# Altium schematic sheet BMS Module.SchDoc
size A3
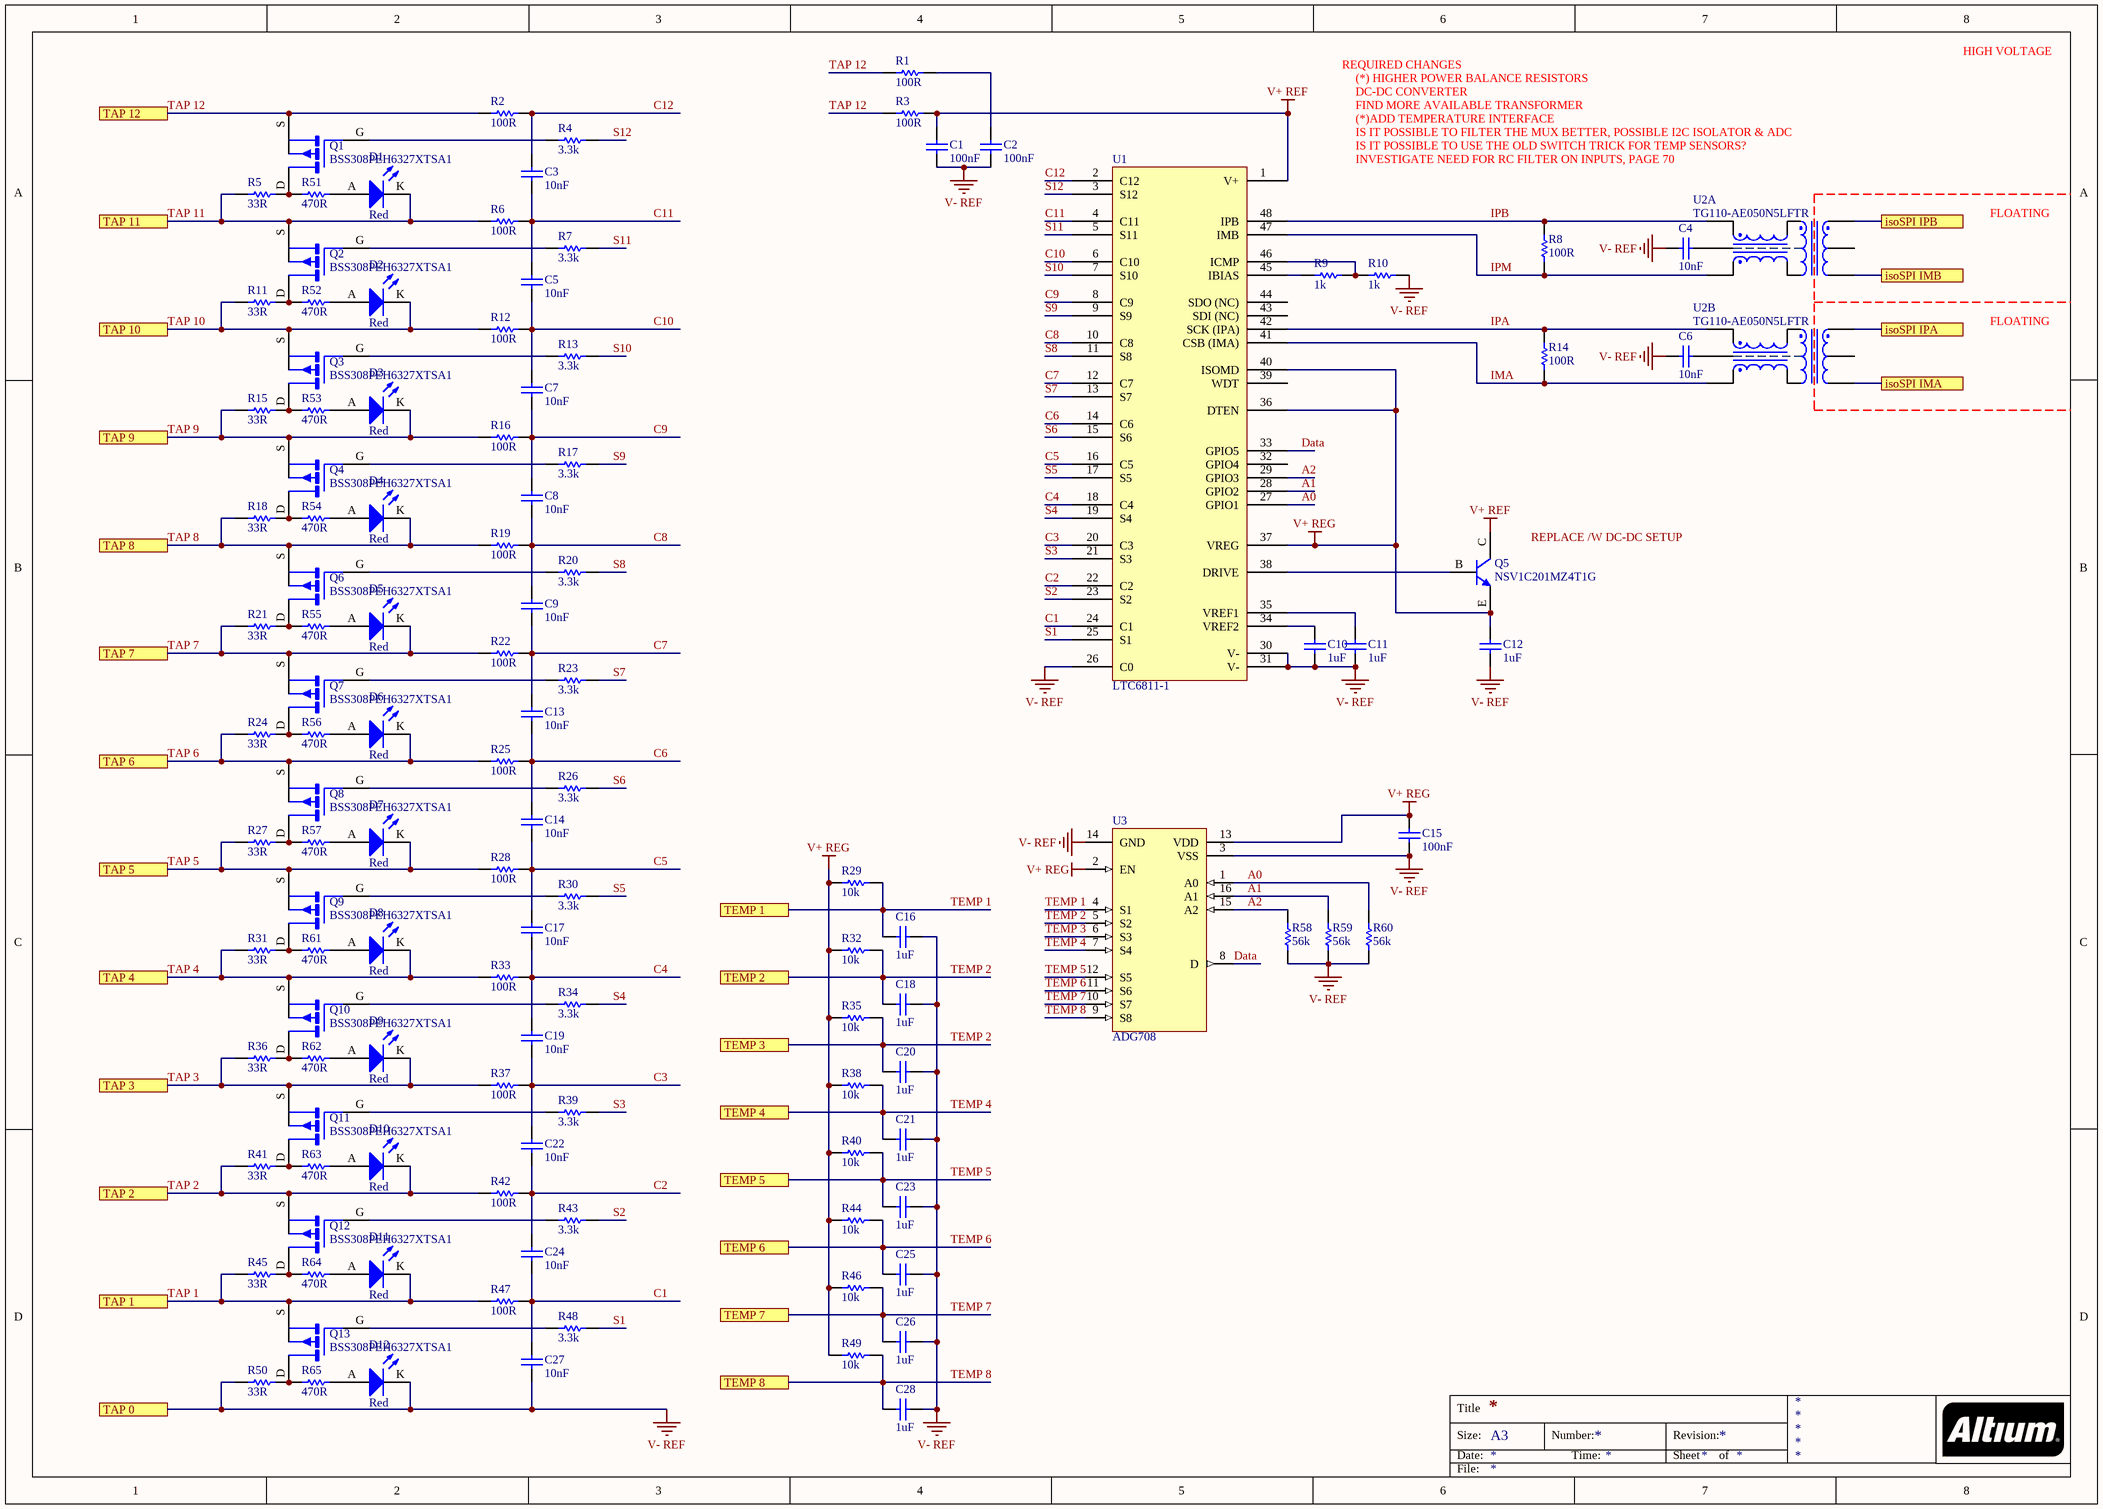
[diagram p0: BMS Module.SchDoc]

## Parts
C1  100nF  [0805]
C2  100nF  [0805]
C3  10nF  [0805]
C4  10nF  [0805]
C5  10nF  [0805]
C6  10nF  [0805]
C7  10nF  [0805]
C8  10nF  [0805]
C9  10nF  [0805]
C10  1uF  [0805]
C11  1uF  [0805]
C12  1uF  [0805]
C13  10nF  [0805]
C14  10nF  [0805]
C15  100nF  [0805]
C16  1uF  [0805]
C17  10nF  [0805]
C18  1uF  [0805]
C19  10nF  [0805]
C20  1uF  [0805]
C21  1uF  [0805]
C22  10nF  [0805]
C23  1uF  [0805]
C24  10nF  [0805]
C25  1uF  [0805]
C26  1uF  [0805]
C27  10nF  [0805]
C28  1uF  [0805]
D1  Red  [0805 LED]
D2  Red  [0805 LED]
D3  Red  [0805 LED]
D4  Red  [0805 LED]
D5  Red  [0805 LED]
D6  Red  [0805 LED]
D7  Red  [0805 LED]
D8  Red  [0805 LED]
D9  Red  [0805 LED]
D10  Red  [0805 LED]
D11  Red  [0805 LED]
D12  Red  [0805 LED]
Q1  BSS308PEH6327XTSA1  [IN SOT-23 MOSFET]
Q2  BSS308PEH6327XTSA1  [IN SOT-23 MOSFET]
Q3  BSS308PEH6327XTSA1  [IN SOT-23 MOSFET]
Q4  BSS308PEH6327XTSA1  [IN SOT-23 MOSFET]
Q5  NSV1C201MZ4T1G  [ON SOT-223 BJT]
Q6  BSS308PEH6327XTSA1  [IN SOT-23 MOSFET]
Q7  BSS308PEH6327XTSA1  [IN SOT-23 MOSFET]
Q8  BSS308PEH6327XTSA1  [IN SOT-23 MOSFET]
Q9  BSS308PEH6327XTSA1  [IN SOT-23 MOSFET]
Q10  BSS308PEH6327XTSA1  [IN SOT-23 MOSFET]
Q11  BSS308PEH6327XTSA1  [IN SOT-23 MOSFET]
Q12  BSS308PEH6327XTSA1  [IN SOT-23 MOSFET]
Q13  BSS308PEH6327XTSA1  [IN SOT-23 MOSFET]
R1  100R  [0805]
R2  100R  [0805]
R3  100R  [2512]
R4  3.3k  [0805]
R5  33R  [2512]
R6  100R  [0805]
R7  3.3k  [0805]
R8  100R  [0805]
R9  1k  [0805]
R10  1k  [0805]
R11  33R  [2512]
R12  100R  [0805]
R13  3.3k  [0805]
R14  100R  [0805]
R15  33R  [2512]
R16  100R  [0805]
R17  3.3k  [0805]
R18  33R  [2512]
R19  100R  [0805]
R20  3.3k  [0805]
R21  33R  [2512]
R22  100R  [0805]
R23  3.3k  [0805]
R24  33R  [2512]
R25  100R  [0805]
R26  3.3k  [0805]
R27  33R  [2512]
R28  100R  [0805]
R29  10k  [0805]
R30  3.3k  [0805]
R31  33R  [2512]
R32  10k  [0805]
R33  100R  [0805]
R34  3.3k  [0805]
R35  10k  [0805]
R36  33R  [2512]
R37  100R  [0805]
R38  10k  [0805]
R39  3.3k  [0805]
R40  10k  [0805]
R41  33R  [2512]
R42  100R  [0805]
R43  3.3k  [0805]
R44  10k  [0805]
R45  33R  [2512]
R46  10k  [0805]
R47  100R  [0805]
R48  3.3k  [0805]
R49  10k  [0805]
R50  33R  [2512]
R51  470R  [0805]
R52  470R  [0805]
R53  470R  [0805]
R54  470R  [0805]
R55  470R  [0805]
R56  470R  [0805]
R57  470R  [0805]
R58  56k  [0805]
R59  56k  [0805]
R60  56k  [0805]
R61  470R  [0805]
R62  470R  [0805]
R63  470R  [0805]
R64  470R  [0805]
R65  470R  [0805]
U1  LTC6811-1  [LT 48-SSOP]
U2  TG110-AE050N5LFTR  [HALO N5]  (parts A,B of 2)
U3  ADG708  [AD 16-TSSOP]

## Ports
isoSPI IMA, isoSPI IMB, isoSPI IPA, isoSPI IPB, TAP 0, TAP 1, TAP 2, TAP 3, TAP 4, TAP 5, TAP 6, TAP 7, TAP 8, TAP 9, TAP 10, TAP 11, TAP 12, TEMP 1, TEMP 2, TEMP 3, TEMP 4, TEMP 5, TEMP 6, TEMP 7, TEMP 8

## Nets
V+ REF: C1.2 Q5.C R3.2 U1.1(V+)
V+ REG: C12.2 C15.2 Q5.E R29.1 R32.1 R35.1 R38.1 R40.1 R44.1 R46.1 R49.1 U1.36(DTEN) U1.37(VREG) U1.40(ISOMD) U3.2(EN) U3.13(VDD)
V- REF: C1.1 C2.1 C4.1 C6.1 C10.1 C11.1 C12.1 C15.1 C16.1 C18.1 C20.1 C21.1 C23.1 C25.1 C26.1 C27.1 C28.1 D12.K R10.2 R50.1 R58.1 R59.1 R60.1 U1.26(C0) U1.30(V-) U1.31(V-) U3.3(VSS) U3.14(GND) ; port TAP 0
A0: R60.2 U1.27(GPIO1) U3.1(A0)
A1: R59.2 U1.28(GPIO2) U3.16(A1)
A2: R58.2 U1.29(GPIO3) U3.15(A2)
C1: C24.1 C27.2 R47.2 U1.24(C1)
C2: C22.1 C24.2 R42.2 U1.22(C2)
C3: C19.1 C22.2 R37.2 U1.20(C3)
C4: C17.1 C19.2 R33.2 U1.18(C4)
C5: C14.1 C17.2 R28.2 U1.16(C5)
C6: C13.1 C14.2 R25.2 U1.14(C6)
C7: C9.1 C13.2 R22.2 U1.12(C7)
C8: C8.1 C9.2 R19.2 U1.10(C8)
C9: C7.1 C8.2 R16.2 U1.8(C9)
C10: C5.1 C7.2 R12.2 U1.6(C10)
C11: C3.1 C5.2 R6.2 U1.4(C11)
C12: C3.2 R2.2 U1.2(C12)
Data: U1.33(GPIO5) U3.8(D)
IMA: R14.1 U1.41(CSB_(IMA)) U2.8
IPA: R14.2 U1.42(SCK_(IPA)) U2.6
IPB: R8.2 U1.48(IPB) U2.1
IPM: R8.1 U1.47(IMB) U2.3
isoSPI IMA: U2.9 ; port isoSPI IMA
isoSPI IMB: U2.14 ; port isoSPI IMB
isoSPI IPA: U2.11 ; port isoSPI IPA
isoSPI IPB: U2.16 ; port isoSPI IPB
S1: R48.2 U1.25(S1)
S2: R43.2 U1.23(S2)
S3: R39.2 U1.21(S3)
S4: R34.2 U1.19(S4)
S5: R30.2 U1.17(S5)
S6: R26.2 U1.15(S6)
S7: R23.2 U1.13(S7)
S8: R20.2 U1.11(S8)
S9: R17.2 U1.9(S9)
S10: R13.2 U1.7(S10)
S11: R7.2 U1.5(S11)
S12: R4.2 U1.3(S12)
TAP 1: D11.K Q13.S R45.1 R47.1 ; port TAP 1
TAP 2: D10.K Q12.S R41.1 R42.1 ; port TAP 2
TAP 3: D9.K Q11.S R36.1 R37.1 ; port TAP 3
TAP 4: D8.K Q10.S R31.1 R33.1 ; port TAP 4
TAP 5: D7.K Q9.S R27.1 R28.1 ; port TAP 5
TAP 6: D6.K Q8.S R24.1 R25.1 ; port TAP 6
TAP 7: D5.K Q7.S R21.1 R22.1 ; port TAP 7
TAP 8: D4.K Q6.S R18.1 R19.1 ; port TAP 8
TAP 9: D3.K Q4.S R15.1 R16.1 ; port TAP 9
TAP 10: D2.K Q3.S R11.1 R12.1 ; port TAP 10
TAP 11: D1.K Q2.S R5.1 R6.1 ; port TAP 11
TAP 12: Q1.S R1.1 R2.1 R3.1 ; port TAP 12
TEMP 1: C16.2 R29.2 U3.4(S1) ; port TEMP 1
TEMP 2: C18.2 C20.2 R32.2 R35.2 U3.5(S2) ; port TEMP 2, port TEMP 3
TEMP 3: U3.6(S3)
TEMP 4: C21.2 R38.2 U3.7(S4) ; port TEMP 4
TEMP 5: C23.2 R40.2 U3.12(S5) ; port TEMP 5
TEMP 6: C25.2 R44.2 U3.11(S6) ; port TEMP 6
TEMP 7: C26.2 R46.2 U3.10(S7) ; port TEMP 7
TEMP 8: C28.2 R49.2 U3.9(S8) ; port TEMP 8
NetC2_2: C2.2 R1.2
NetC4_2: C4.2 U2.2
NetC6_2: C6.2 U2.7
NetC10_2: C10.2 U1.34(VREF2)
NetC11_2: C11.2 U1.35(VREF1)
NetD1_A: D1.A R51.2
NetD2_A: D2.A R52.2
NetD3_A: D3.A R53.2
NetD4_A: D4.A R54.2
NetD5_A: D5.A R55.2
NetD6_A: D6.A R56.2
NetD7_A: D7.A R57.2
NetD8_A: D8.A R61.2
NetD9_A: D9.A R62.2
NetD10_A: D10.A R63.2
NetD11_A: D11.A R64.2
NetD12_A: D12.A R65.2
NetQ1_D: Q1.D R5.2 R51.1
NetQ1_G: Q1.G R4.1
NetQ2_D: Q2.D R11.2 R52.1
NetQ2_G: Q2.G R7.1
NetQ3_D: Q3.D R15.2 R53.1
NetQ3_G: Q3.G R13.1
NetQ4_D: Q4.D R18.2 R54.1
NetQ4_G: Q4.G R17.1
NetQ5_B: Q5.B U1.38(DRIVE)
NetQ6_D: Q6.D R21.2 R55.1
NetQ6_G: Q6.G R20.1
NetQ7_D: Q7.D R24.2 R56.1
NetQ7_G: Q7.G R23.1
NetQ8_D: Q8.D R27.2 R57.1
NetQ8_G: Q8.G R26.1
NetQ9_D: Q9.D R31.2 R61.1
NetQ9_G: Q9.G R30.1
NetQ10_D: Q10.D R36.2 R62.1
NetQ10_G: Q10.G R34.1
NetQ11_D: Q11.D R41.2 R63.1
NetQ11_G: Q11.G R39.1
NetQ12_D: Q12.D R45.2 R64.1
NetQ12_G: Q12.G R43.1
NetQ13_D: Q13.D R50.2 R65.1
NetQ13_G: Q13.G R48.1
NetR9_1: R9.1 U1.45(IBIAS)
NetR9_2: R9.2 R10.1 U1.46(ICMP)

Not connected (* = marked no-connect by the designer): U1 32(GPIO4) 39(WDT) 43(SDI_(NC)) 44(SDO_(NC)); U2 10 15

## Notes on the sheet
- HIGH VOLTAGE
- (*)ADD TEMPERATURE INTERFACE
- IS IT POSSIBLE TO FILTER THE MUX BETTER, POSSIBLE I2C ISOLATOR & ADC
- IS IT POSSIBLE TO USE THE OLD SWITCH TRICK FOR TEMP SENSORS?
- INVESTIGATE NEED FOR RC FILTER ON INPUTS, PAGE 70
- FLOATING
- Labels drawn without touching a wire or pin: (*) HIGHER POWER BALANCE RESISTORS, DC-DC CONVERTER, FIND MORE AVAILABLE TRANSFORMER, REPLACE /W DC-DC SETUP, REQUIRED CHANGES
- Title
- Size:
- Date:
- A3
- Number:
- Time:
- Revision:
- Sheet
- of
- File:

## Library data of the parts
C1 C2 C15 = GCM21BR71E104KA37L: Manufacturer: muRata; Tolerance: 10%; Material: X7R; Rated Voltage: 25V; Part Number: GCM21BR71E104KA37L; Value: 100nF
C3-C9 C13 C14 C17 C19 C22 C24 C27 = GCM21BR71H103KA37L: Manufacturer: muRata; Tolerance: 10%; Material: X7R; Rated Voltage: 50V; Part Number: GCM21BR71H103KA37L; Value: 10nF
C10-C12 C16 C18 C20 C21 C23 C25 C26 C28 = AC0805KKX7R8BB105: Manufacturer: YAGEO; Tolerance: 10%; Material: X7R; Rated Voltage: 25V; Part Number: AC0805KKX7R8BB105; Value: 1uF
D1-D12 = SML-210LTT86: Red LED Indication - Discrete 1.75V 0805 (2012 Metric); Manufacturer: ROHM Semiconductor; Part Number: SML-210LTT86; Colour: Red; Digikey Part Number: 511-1286-1-ND; Digikey Link: https://www.digikey.com/product-detail/en/rohm-semiconductor/SML-210LTT86/511-1286-1-ND/637099
Q1-Q4 Q6-Q13 = BSS308PEH6327XTSA1: P-Channel 30V 2A (Ta) 500mW (Ta) Surface Mount SOT-23-3; Manufacturer: Infineon Technologies; Published: 24-Mar-1999; LatestRevisionDate: 29-May-2009; LatestRevisionNote: IPC-7351 Footprint Added.; PackageVersion: Sep-2000; PackageReference: SOT-343; Publisher: Altium Limited; PackageDescription: 4-Pin SOT-343 Package 1.3 mm Pitch, 2.1 mm Lead Span; Part Number: BSS308PEH6327XTSA1; Digikey Part Number: BSS308PEH6327XTSA1CT-ND; Digikey Link: https://www.digikey.com/product-detail/en/infineon-technologies/BSS308PEH6327XTSA1/BSS308PEH6327XTSA1CT-ND/3196649
Q5 = NSV1C201MZ4T1G: Bipolar (BJT) Transistor NPN 100V 2A 100MHz 800mW Surface Mount SOT-223 (TO-261); Manufacturer: ON Semiconductor; Part Number: NSV1C201MZ4T1G; Digikey Part Number: NSV1C201MZ4T1GOSCT-ND; Digikey Link: https://www.digikey.com/product-detail/en/on-semiconductor/NSV1C201MZ4T1G/NSV1C201MZ4T1GOSCT-ND/5969293
R1 R2 R6 R8 R12 R14 R16 R19 R22 R25 R28 R33 R37 R42 R47 = RC0805FR07100RL: Manufacturer: YAGEO; Tolerance: 0.01; Rated Voltage: 0.125W; Part Number: RC0805FR07100RL; Value: 100R; Material: FR-07
R3 = 3521100RFT: Manufacturer: TE Connectivity; Tolerance: 0.01; Rated Voltage: 2W; Part Number: 3521100RFT; Value: 100R; Digikey Part Number: A116008CT-ND
R4 R7 R13 R17 R20 R23 R26 R30 R34 R39 R43 R48 = RC0805FR073K3L: Manufacturer: YAGEO; Tolerance: 0.01; Rated Voltage: 0.125W; Part Number: RC0805FR073K3L; Value: 3.3k; Material: FR-07
R5 R11 R15 R18 R21 R24 R27 R31 R36 R41 R45 R50 = 352133RFT: Manufacturer: TE Connectivity; Tolerance: 0.01; Rated Voltage: 2W; Part Number: 352133RFT; Value: 33R; Digikey Part Number: A115996CT-ND
R9 R10 = RC0805FR071KL: Manufacturer: YAGEO; Tolerance: 0.01; Rated Voltage: 0.125W; Part Number: RC0805FR071KL; Value: 1k; Material: FR-07; Digikey Part Number: 311-1.00KCRCT-ND
R29 R32 R35 R38 R40 R44 R46 R49 = RC0805FR0710KL: Manufacturer: YAGEO; Tolerance: 0.01; Rated Voltage: 0.125W; Part Number: RC0805FR0710KL; Value: 10k; Material: FR-07
R51-R57 R61-R65 = RC0805FR07470RL: Manufacturer: YAGEO; Tolerance: 0.01; Rated Voltage: 0.125W; Part Number: RC0805FR07470RL; Value: 470R; Material: FR-07
R58-R60 = RC0805FR0756KL: Manufacturer: YAGEO; Tolerance: 0.01; Rated Voltage: 0.125W; Part Number: RC0805FR0756KL; Value: 56k; Material: FR-07
U1 = LTC6811-1: Battery Battery Monitor IC Multi-Chemistry 48-SSOP; Manufacturer: Analog Devices; Part Number: LTC6811-1; Digikey Part Number: LTC6811HG-1#PBF-ND; Digikey Link: https://www.digikey.com/product-detail/en/linear-technology-analog-devices/LTC6811HG-1-PBF/LTC6811HG-1-PBF-ND/6235369
U2 = TG110-AE050N5LFTR: Audio Transformers / Signal Transformers 10/100BASE-TX SMD AEC-Q200 16P 1-Port; Manufacturer: HALO; Part Number: TG110-AE050N5LFTR; Supplier Part Number: 493-TG110AE050N5LFTR; Link: https://au.mouser.com/ProductDetail/HALO-Electronics/TG110-AE050N5LFTR?qs=sGAEpiMZZMv0IfuNuy2LUfZdSvNuW2VyV%2FR9bgCA%2FOQ%3D
U3 = ADG708: 1 Circuit IC Switch 8:1 4.5Ohm 16-TSSOP; Manufacturer: Analog Devices; Part Number: ADG708; Digikey Part Number: ADG708BRUZ-ND; Digikey Link: https://www.digikey.com/product-detail/en/analog-devices-inc/ADG708BRUZ/ADG708BRUZ-ND/820104